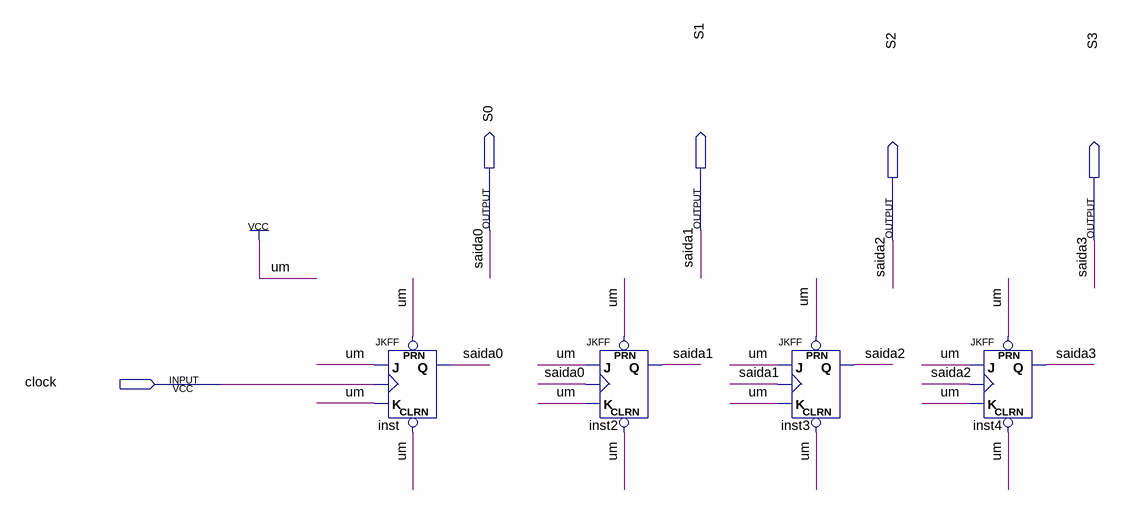
[diagram p0: schematic sheet]
// Quartus schematic ContAssin4bits.bdf as structural Verilog: 4 symbols, 5 pins
module ContAssin4bits (
  input  clock,
  output S0,
  output S1,
  output S2,
  output S3
);

  JKFF inst (.PRN(1'b1), .CLRN(1'b1), .K(1'b1), .J(1'b1), .CLK(clock), .Q(S0));
  JKFF inst2 (.PRN(1'b1), .CLRN(1'b1), .K(1'b1), .J(1'b1), .CLK(S0), .Q(S1));
  JKFF inst3 (.PRN(1'b1), .CLRN(1'b1), .K(1'b1), .J(1'b1), .CLK(S1), .Q(S2));
  JKFF inst4 (.PRN(1'b1), .CLRN(1'b1), .K(1'b1), .J(1'b1), .CLK(S2), .Q(S3));

  // Other names for the same wires on the sheet: saida0 = S0; saida1 = S1; saida2 = S2; saida3 = S3
endmodule
